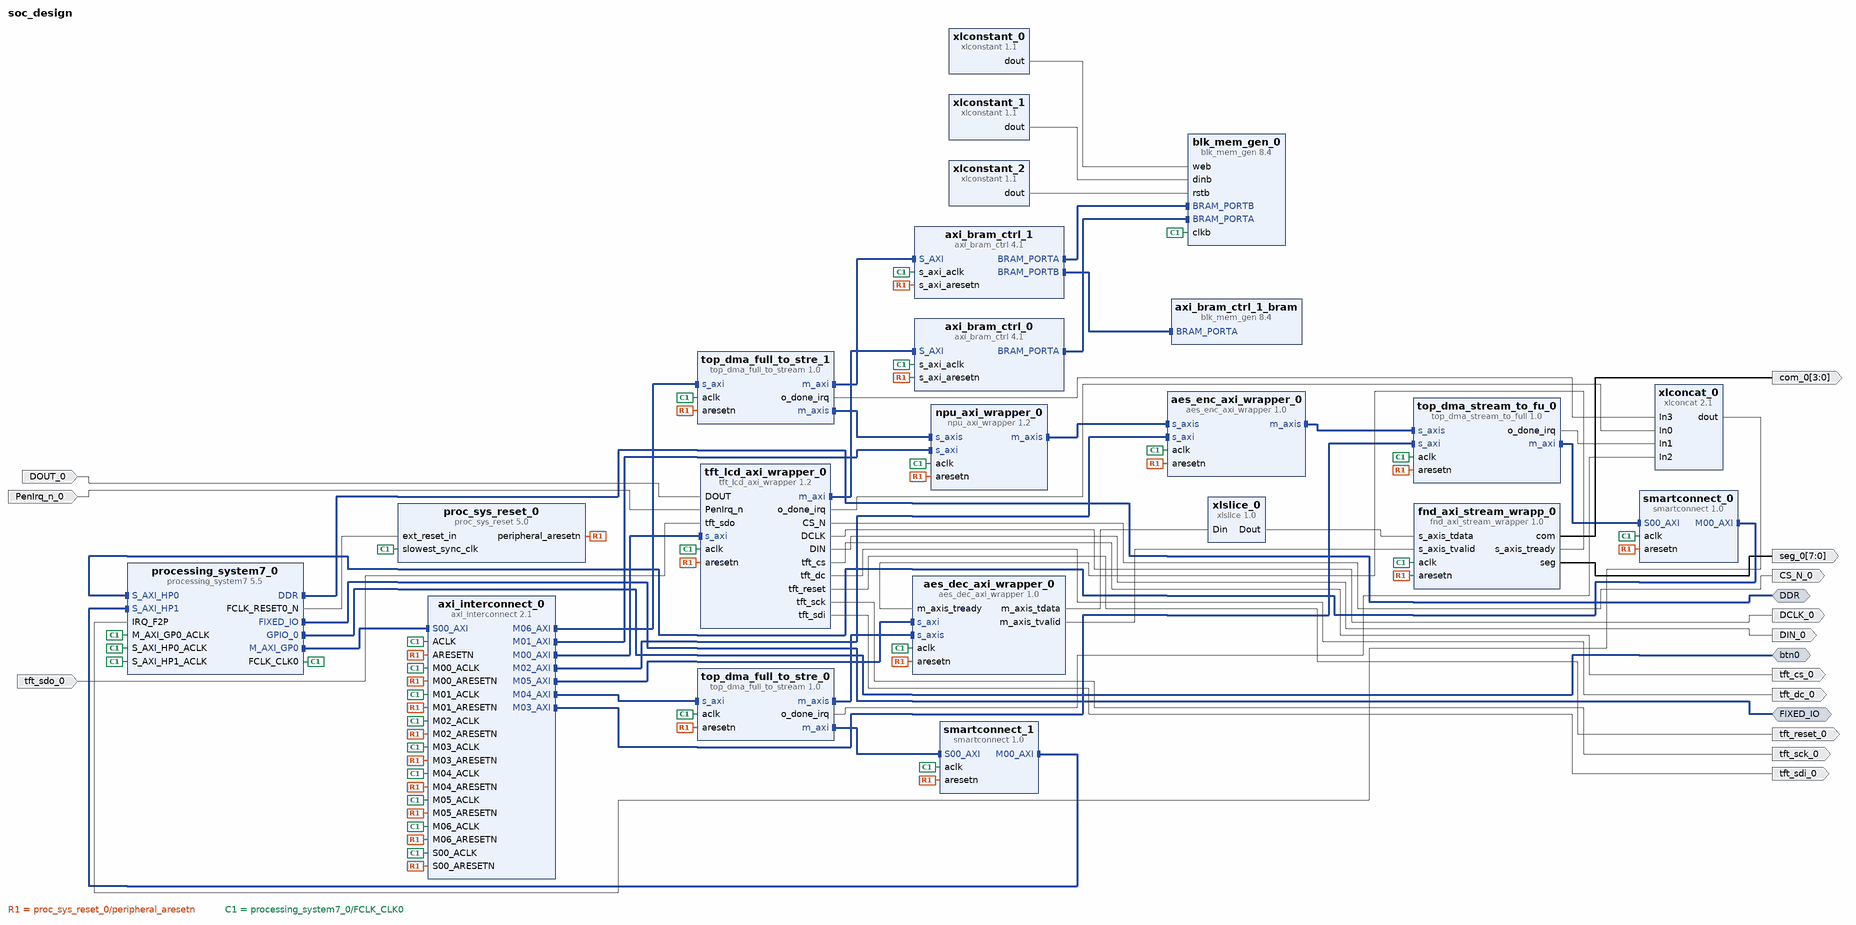
[diagram p0: block diagram of the top level]
# Vivado block design soc_design, xc7z020clg400-1, Vivado 2024.2
create_bd_design soc_design

create_bd_intf_port -mode Master -vlnv xilinx.com:interface:ddrx_rtl:1.0 DDR
create_bd_intf_port -mode Master -vlnv xilinx.com:display_processing_system7:fixedio_rtl:1.0 FIXED_IO
create_bd_intf_port -mode Master -vlnv xilinx.com:interface:gpio_rtl:1.0 btn0
create_bd_port -dir O -from 7 -to 0 seg_0
create_bd_port -dir O -from 3 -to 0 com_0
create_bd_port -dir O CS_N_0
create_bd_port -dir O DCLK_0
create_bd_port -dir O DIN_0
create_bd_port -dir I DOUT_0
create_bd_port -dir I PenIrq_n_0
create_bd_port -dir O tft_cs_0
create_bd_port -dir O tft_dc_0
create_bd_port -dir O tft_reset_0
create_bd_port -dir O tft_sck_0
create_bd_port -dir O tft_sdi_0
create_bd_port -dir I tft_sdo_0

create_bd_cell -type ip -vlnv xilinx.com:ip:processing_system7:5.5 processing_system7_0
set_property -dict [list \
  CONFIG.PCW_APU_PERIPHERAL_FREQMHZ 667 \
  CONFIG.PCW_ENET0_ENET0_IO {MIO 16 .. 27} \
  CONFIG.PCW_ENET0_GRP_MDIO_ENABLE 1 \
  CONFIG.PCW_ENET0_GRP_MDIO_IO {MIO 52 .. 53} \
  CONFIG.PCW_ENET0_PERIPHERAL_ENABLE 1 \
  CONFIG.PCW_ENET0_RESET_ENABLE 0 \
  CONFIG.PCW_ENET_RESET_ENABLE 1 \
  CONFIG.PCW_ENET_RESET_SELECT {Share reset pin} \
  CONFIG.PCW_FPGA0_PERIPHERAL_FREQMHZ 50 \
  CONFIG.PCW_FPGA1_PERIPHERAL_FREQMHZ 50 \
  CONFIG.PCW_GPIO_EMIO_GPIO_ENABLE 1 \
  CONFIG.PCW_GPIO_EMIO_GPIO_IO 1 \
  CONFIG.PCW_GPIO_EMIO_GPIO_WIDTH 1 \
  CONFIG.PCW_GPIO_MIO_GPIO_ENABLE 1 \
  CONFIG.PCW_GPIO_MIO_GPIO_IO MIO \
  CONFIG.PCW_I2C_RESET_ENABLE 1 \
  CONFIG.PCW_IRQ_F2P_INTR 1 \
  CONFIG.PCW_PERIPHERAL_BOARD_PRESET part0 \
  CONFIG.PCW_PRESET_BANK1_VOLTAGE {LVCMOS 1.8V} \
  CONFIG.PCW_QSPI_GRP_FBCLK_ENABLE 1 \
  CONFIG.PCW_QSPI_GRP_FBCLK_IO {MIO 8} \
  CONFIG.PCW_QSPI_GRP_SINGLE_SS_ENABLE 1 \
  CONFIG.PCW_QSPI_GRP_SINGLE_SS_IO {MIO 1 .. 6} \
  CONFIG.PCW_QSPI_PERIPHERAL_ENABLE 1 \
  CONFIG.PCW_QSPI_QSPI_IO {MIO 1 .. 6} \
  CONFIG.PCW_SD0_GRP_CD_ENABLE 1 \
  CONFIG.PCW_SD0_GRP_CD_IO {MIO 47} \
  CONFIG.PCW_SD0_GRP_WP_ENABLE 0 \
  CONFIG.PCW_SD0_PERIPHERAL_ENABLE 1 \
  CONFIG.PCW_SD0_SD0_IO {MIO 40 .. 45} \
  CONFIG.PCW_SDIO_PERIPHERAL_FREQMHZ 50 \
  CONFIG.PCW_SINGLE_QSPI_DATA_MODE x4 \
  CONFIG.PCW_UART1_PERIPHERAL_ENABLE 1 \
  CONFIG.PCW_UART1_UART1_IO {MIO 48 .. 49} \
  CONFIG.PCW_UART_PERIPHERAL_FREQMHZ 100 \
  CONFIG.PCW_UIPARAM_DDR_FREQ_MHZ 533.333333 \
  CONFIG.PCW_UIPARAM_DDR_MEMORY_TYPE {DDR 3 (Low Voltage)} \
  CONFIG.PCW_UIPARAM_DDR_PARTNO {MT41K256M16 RE-125} \
  CONFIG.PCW_USB0_PERIPHERAL_ENABLE 1 \
  CONFIG.PCW_USB0_RESET_ENABLE 1 \
  CONFIG.PCW_USB0_RESET_IO {MIO 46} \
  CONFIG.PCW_USB0_USB0_IO {MIO 28 .. 39} \
  CONFIG.PCW_USB_RESET_ENABLE 1 \
  CONFIG.PCW_USB_RESET_SELECT {Share reset pin} \
  CONFIG.PCW_USE_FABRIC_INTERRUPT 1 \
  CONFIG.PCW_USE_S_AXI_HP0 1 \
  CONFIG.PCW_USE_S_AXI_HP1 1 \
  CONFIG.preset None \
] [get_bd_cells processing_system7_0]
# 509 more settings of processing_system7_0 are not shown: defaults, MIO pin electricals, DDR timing, and values the tool derives
create_bd_cell -type ip -vlnv xilinx.com:ip:proc_sys_reset:5.0 proc_sys_reset_0
create_bd_cell -type ip -vlnv xilinx.com:user:top_dma_stream_to_full:1.0 top_dma_stream_to_fu_0
create_bd_cell -type ip -vlnv xilinx.com:user:aes_dec_axi_wrapper:1.0 aes_dec_axi_wrapper_0
create_bd_cell -type ip -vlnv xilinx.com:user:aes_enc_axi_wrapper:1.0 aes_enc_axi_wrapper_0
create_bd_cell -type ip -vlnv xilinx.com:ip:axi_interconnect:2.1 axi_interconnect_0
set_property -dict {CONFIG.NUM_MI 7} [get_bd_cells axi_interconnect_0]
create_bd_cell -type ip -vlnv xilinx.com:ip:smartconnect:1.0 smartconnect_0
set_property -dict {CONFIG.NUM_SI 1} [get_bd_cells smartconnect_0]
create_bd_cell -type ip -vlnv xilinx.com:ip:smartconnect:1.0 smartconnect_1
set_property -dict {CONFIG.NUM_SI 1} [get_bd_cells smartconnect_1]
create_bd_cell -type ip -vlnv xilinx.com:ip:xlconcat:2.1 xlconcat_0
set_property -dict {CONFIG.NUM_PORTS 4} [get_bd_cells xlconcat_0]
create_bd_cell -type ip -vlnv xilinx.com:user:fnd_axi_stream_wrapper:1.0 fnd_axi_stream_wrapp_0
create_bd_cell -type ip -vlnv xilinx.com:ip:xlslice:1.0 xlslice_0
set_property -dict {CONFIG.DIN_FROM 3 CONFIG.DIN_TO 0 CONFIG.DIN_WIDTH 128 CONFIG.DOUT_WIDTH 4} [get_bd_cells xlslice_0]
create_bd_cell -type ip -vlnv xilinx.com:user:tft_lcd_axi_wrapper:1.2 tft_lcd_axi_wrapper_0
create_bd_cell -type ip -vlnv xilinx.com:ip:blk_mem_gen:8.4 blk_mem_gen_0
set_property -dict {CONFIG.Memory_Type True_Dual_Port_RAM} [get_bd_cells blk_mem_gen_0]
create_bd_cell -type ip -vlnv xilinx.com:ip:xlconstant:1.1 xlconstant_0
set_property -dict {CONFIG.CONST_VAL 0 CONFIG.CONST_WIDTH 4} [get_bd_cells xlconstant_0]
create_bd_cell -type ip -vlnv xilinx.com:ip:xlconstant:1.1 xlconstant_1
set_property -dict {CONFIG.CONST_VAL 0 CONFIG.CONST_WIDTH 32} [get_bd_cells xlconstant_1]
create_bd_cell -type ip -vlnv xilinx.com:ip:xlconstant:1.1 xlconstant_2
set_property -dict {CONFIG.CONST_VAL 0} [get_bd_cells xlconstant_2]
create_bd_cell -type ip -vlnv xilinx.com:ip:axi_bram_ctrl:4.1 axi_bram_ctrl_0
set_property -dict {CONFIG.SINGLE_PORT_BRAM 1} [get_bd_cells axi_bram_ctrl_0]
create_bd_cell -type ip -vlnv xilinx.com:user:top_dma_full_to_stream:1.0 top_dma_full_to_stre_0
create_bd_cell -type ip -vlnv xilinx.com:user:npu_axi_wrapper:1.2 npu_axi_wrapper_0
create_bd_cell -type ip -vlnv xilinx.com:user:top_dma_full_to_stream:1.0 top_dma_full_to_stre_1
set_property -dict {CONFIG.C_M_AXIS_DATA_WIDTH 32} [get_bd_cells top_dma_full_to_stre_1]
create_bd_cell -type ip -vlnv xilinx.com:ip:axi_bram_ctrl:4.1 axi_bram_ctrl_1
create_bd_cell -type ip -vlnv xilinx.com:ip:blk_mem_gen:8.4 axi_bram_ctrl_1_bram

# ---- connections ----

connect_bd_intf_net [get_bd_intf_pins aes_enc_axi_wrapper_0/m_axis] [get_bd_intf_pins top_dma_stream_to_fu_0/s_axis]
connect_bd_intf_net [get_bd_intf_pins axi_bram_ctrl_0/BRAM_PORTA] [get_bd_intf_pins blk_mem_gen_0/BRAM_PORTA]
connect_bd_intf_net [get_bd_intf_pins axi_bram_ctrl_1/BRAM_PORTA] [get_bd_intf_pins blk_mem_gen_0/BRAM_PORTB]
connect_bd_intf_net [get_bd_intf_pins axi_bram_ctrl_1_bram/BRAM_PORTA] [get_bd_intf_pins axi_bram_ctrl_1/BRAM_PORTB]
connect_bd_intf_net [get_bd_intf_pins axi_interconnect_0/M00_AXI] [get_bd_intf_pins tft_lcd_axi_wrapper_0/s_axi]
connect_bd_intf_net [get_bd_intf_pins axi_interconnect_0/M01_AXI] [get_bd_intf_pins npu_axi_wrapper_0/s_axi]
connect_bd_intf_net [get_bd_intf_pins aes_enc_axi_wrapper_0/s_axi] [get_bd_intf_pins axi_interconnect_0/M02_AXI]
connect_bd_intf_net [get_bd_intf_pins top_dma_stream_to_fu_0/s_axi] [get_bd_intf_pins axi_interconnect_0/M03_AXI]
connect_bd_intf_net [get_bd_intf_pins axi_interconnect_0/M04_AXI] [get_bd_intf_pins top_dma_full_to_stre_0/s_axi]
connect_bd_intf_net [get_bd_intf_pins axi_interconnect_0/M05_AXI] [get_bd_intf_pins aes_dec_axi_wrapper_0/s_axi]
connect_bd_intf_net [get_bd_intf_pins axi_interconnect_0/M06_AXI] [get_bd_intf_pins top_dma_full_to_stre_1/s_axi]
connect_bd_intf_net [get_bd_intf_pins npu_axi_wrapper_0/m_axis] [get_bd_intf_pins aes_enc_axi_wrapper_0/s_axis]
connect_bd_intf_net [get_bd_intf_ports DDR] [get_bd_intf_pins processing_system7_0/DDR]
connect_bd_intf_net [get_bd_intf_ports FIXED_IO] [get_bd_intf_pins processing_system7_0/FIXED_IO]
connect_bd_intf_net [get_bd_intf_ports btn0] [get_bd_intf_pins processing_system7_0/GPIO_0]
connect_bd_intf_net [get_bd_intf_pins processing_system7_0/M_AXI_GP0] [get_bd_intf_pins axi_interconnect_0/S00_AXI]
connect_bd_intf_net [get_bd_intf_pins smartconnect_0/M00_AXI] [get_bd_intf_pins processing_system7_0/S_AXI_HP0]
connect_bd_intf_net [get_bd_intf_pins smartconnect_1/M00_AXI] [get_bd_intf_pins processing_system7_0/S_AXI_HP1]
connect_bd_intf_net [get_bd_intf_pins tft_lcd_axi_wrapper_0/m_axi] [get_bd_intf_pins axi_bram_ctrl_0/S_AXI]
connect_bd_intf_net [get_bd_intf_pins smartconnect_1/S00_AXI] [get_bd_intf_pins top_dma_full_to_stre_0/m_axi]
connect_bd_intf_net [get_bd_intf_pins top_dma_full_to_stre_0/m_axis] [get_bd_intf_pins aes_dec_axi_wrapper_0/s_axis]
connect_bd_intf_net [get_bd_intf_pins top_dma_full_to_stre_1/m_axi] [get_bd_intf_pins axi_bram_ctrl_1/S_AXI]
connect_bd_intf_net [get_bd_intf_pins top_dma_full_to_stre_1/m_axis] [get_bd_intf_pins npu_axi_wrapper_0/s_axis]
connect_bd_intf_net [get_bd_intf_pins smartconnect_0/S00_AXI] [get_bd_intf_pins top_dma_stream_to_fu_0/m_axi]
connect_bd_net -net DOUT_0_1 [get_bd_ports DOUT_0] [get_bd_pins tft_lcd_axi_wrapper_0/DOUT]
connect_bd_net -net PenIrq_n_0_1 [get_bd_ports PenIrq_n_0] [get_bd_pins tft_lcd_axi_wrapper_0/PenIrq_n]
connect_bd_net [get_bd_pins aes_dec_axi_wrapper_0/m_axis_tdata] [get_bd_pins xlslice_0/Din]
connect_bd_net [get_bd_pins aes_dec_axi_wrapper_0/m_axis_tvalid] [get_bd_pins fnd_axi_stream_wrapp_0/s_axis_tvalid]
connect_bd_net [get_bd_pins fnd_axi_stream_wrapp_0/com] [get_bd_ports com_0]
connect_bd_net [get_bd_pins fnd_axi_stream_wrapp_0/s_axis_tready] [get_bd_pins aes_dec_axi_wrapper_0/m_axis_tready]
connect_bd_net [get_bd_pins fnd_axi_stream_wrapp_0/seg] [get_bd_ports seg_0]
connect_bd_net [get_bd_pins proc_sys_reset_0/peripheral_aresetn] \
  [get_bd_pins axi_interconnect_0/M05_ARESETN] [get_bd_pins axi_interconnect_0/M04_ARESETN] \
  [get_bd_pins axi_interconnect_0/M03_ARESETN] [get_bd_pins axi_interconnect_0/M02_ARESETN] \
  [get_bd_pins axi_interconnect_0/M01_ARESETN] [get_bd_pins axi_interconnect_0/M00_ARESETN] \
  [get_bd_pins axi_interconnect_0/S00_ARESETN] [get_bd_pins axi_interconnect_0/ARESETN] [get_bd_pins smartconnect_0/aresetn] \
  [get_bd_pins smartconnect_1/aresetn] [get_bd_pins top_dma_stream_to_fu_0/aresetn] \
  [get_bd_pins aes_dec_axi_wrapper_0/aresetn] [get_bd_pins fnd_axi_stream_wrapp_0/aresetn] \
  [get_bd_pins axi_bram_ctrl_0/s_axi_aresetn] [get_bd_pins top_dma_full_to_stre_0/aresetn] \
  [get_bd_pins aes_enc_axi_wrapper_0/aresetn] [get_bd_pins axi_interconnect_0/M06_ARESETN] \
  [get_bd_pins npu_axi_wrapper_0/aresetn] [get_bd_pins top_dma_full_to_stre_1/aresetn] \
  [get_bd_pins axi_bram_ctrl_1/s_axi_aresetn] [get_bd_pins tft_lcd_axi_wrapper_0/aresetn]
connect_bd_net [get_bd_pins processing_system7_0/FCLK_CLK0] \
  [get_bd_pins proc_sys_reset_0/slowest_sync_clk] [get_bd_pins axi_interconnect_0/ACLK] \
  [get_bd_pins axi_interconnect_0/S00_ACLK] [get_bd_pins axi_interconnect_0/M00_ACLK] \
  [get_bd_pins axi_interconnect_0/M01_ACLK] [get_bd_pins axi_interconnect_0/M02_ACLK] \
  [get_bd_pins axi_interconnect_0/M03_ACLK] [get_bd_pins axi_interconnect_0/M04_ACLK] \
  [get_bd_pins axi_interconnect_0/M05_ACLK] [get_bd_pins smartconnect_1/aclk] [get_bd_pins smartconnect_0/aclk] \
  [get_bd_pins top_dma_stream_to_fu_0/aclk] [get_bd_pins processing_system7_0/S_AXI_HP0_ACLK] \
  [get_bd_pins processing_system7_0/S_AXI_HP1_ACLK] [get_bd_pins processing_system7_0/M_AXI_GP0_ACLK] \
  [get_bd_pins aes_dec_axi_wrapper_0/aclk] [get_bd_pins fnd_axi_stream_wrapp_0/aclk] [get_bd_pins blk_mem_gen_0/clkb] \
  [get_bd_pins axi_bram_ctrl_0/s_axi_aclk] [get_bd_pins top_dma_full_to_stre_0/aclk] [get_bd_pins aes_enc_axi_wrapper_0/aclk] \
  [get_bd_pins axi_interconnect_0/M06_ACLK] [get_bd_pins npu_axi_wrapper_0/aclk] [get_bd_pins top_dma_full_to_stre_1/aclk] \
  [get_bd_pins axi_bram_ctrl_1/s_axi_aclk] [get_bd_pins tft_lcd_axi_wrapper_0/aclk]
connect_bd_net [get_bd_pins processing_system7_0/FCLK_RESET0_N] [get_bd_pins proc_sys_reset_0/ext_reset_in]
connect_bd_net [get_bd_pins tft_lcd_axi_wrapper_0/CS_N] [get_bd_ports CS_N_0]
connect_bd_net [get_bd_pins tft_lcd_axi_wrapper_0/DCLK] [get_bd_ports DCLK_0]
connect_bd_net [get_bd_pins tft_lcd_axi_wrapper_0/DIN] [get_bd_ports DIN_0]
connect_bd_net [get_bd_pins tft_lcd_axi_wrapper_0/o_done_irq] [get_bd_pins xlconcat_0/In0]
connect_bd_net [get_bd_pins tft_lcd_axi_wrapper_0/tft_cs] [get_bd_ports tft_cs_0]
connect_bd_net [get_bd_pins tft_lcd_axi_wrapper_0/tft_dc] [get_bd_ports tft_dc_0]
connect_bd_net [get_bd_pins tft_lcd_axi_wrapper_0/tft_reset] [get_bd_ports tft_reset_0]
connect_bd_net [get_bd_pins tft_lcd_axi_wrapper_0/tft_sck] [get_bd_ports tft_sck_0]
connect_bd_net [get_bd_pins tft_lcd_axi_wrapper_0/tft_sdi] [get_bd_ports tft_sdi_0]
connect_bd_net -net tft_sdo_0_1 [get_bd_ports tft_sdo_0] [get_bd_pins tft_lcd_axi_wrapper_0/tft_sdo]
connect_bd_net [get_bd_pins top_dma_full_to_stre_0/o_done_irq] [get_bd_pins xlconcat_0/In2]
connect_bd_net [get_bd_pins top_dma_full_to_stre_1/o_done_irq] [get_bd_pins xlconcat_0/In3]
connect_bd_net [get_bd_pins top_dma_stream_to_fu_0/o_done_irq] [get_bd_pins xlconcat_0/In1]
connect_bd_net [get_bd_pins xlconcat_0/dout] [get_bd_pins processing_system7_0/IRQ_F2P]
connect_bd_net [get_bd_pins xlconstant_0/dout] [get_bd_pins blk_mem_gen_0/web]
connect_bd_net [get_bd_pins xlconstant_1/dout] [get_bd_pins blk_mem_gen_0/dinb]
connect_bd_net [get_bd_pins xlconstant_2/dout] [get_bd_pins blk_mem_gen_0/rstb]
connect_bd_net [get_bd_pins xlslice_0/Dout] [get_bd_pins fnd_axi_stream_wrapp_0/s_axis_tdata]

# ---- address map ----
assign_bd_address -offset 0x40000000 -range 4K -target_address_space [get_bd_addr_spaces processing_system7_0/Data] [get_bd_addr_segs aes_dec_axi_wrapper_0/s_axi/reg0]
assign_bd_address -offset 0x40001000 -range 4K -target_address_space [get_bd_addr_spaces processing_system7_0/Data] [get_bd_addr_segs aes_enc_axi_wrapper_0/s_axi/reg0]
assign_bd_address -offset 0x40002000 -range 4K -target_address_space [get_bd_addr_spaces processing_system7_0/Data] [get_bd_addr_segs npu_axi_wrapper_0/s_axi/reg0]
assign_bd_address -offset 0x40003000 -range 4K -target_address_space [get_bd_addr_spaces processing_system7_0/Data] [get_bd_addr_segs tft_lcd_axi_wrapper_0/s_axi/reg0]
assign_bd_address -offset 0x40004000 -range 4K -target_address_space [get_bd_addr_spaces processing_system7_0/Data] [get_bd_addr_segs top_dma_full_to_stre_0/s_axi/reg0]
assign_bd_address -offset 0x40005000 -range 4K -target_address_space [get_bd_addr_spaces processing_system7_0/Data] [get_bd_addr_segs top_dma_stream_to_fu_0/s_axi/reg0]
assign_bd_address -offset 0x40006000 -range 4K -target_address_space [get_bd_addr_spaces processing_system7_0/Data] [get_bd_addr_segs top_dma_full_to_stre_1/s_axi/reg0]
assign_bd_address -offset 0xC0000000 -range 8K -target_address_space [get_bd_addr_spaces tft_lcd_axi_wrapper_0/m_axi] [get_bd_addr_segs axi_bram_ctrl_0/S_AXI/Mem0]
assign_bd_address -offset 0x00000000 -range 1G -target_address_space [get_bd_addr_spaces top_dma_full_to_stre_0/m_axi] [get_bd_addr_segs processing_system7_0/S_AXI_HP1/HP1_DDR_LOWOCM]
assign_bd_address -offset 0xC0000000 -range 8K -target_address_space [get_bd_addr_spaces top_dma_full_to_stre_1/m_axi] [get_bd_addr_segs axi_bram_ctrl_1/S_AXI/Mem0]
assign_bd_address -offset 0x00000000 -range 1G -target_address_space [get_bd_addr_spaces top_dma_stream_to_fu_0/m_axi] [get_bd_addr_segs processing_system7_0/S_AXI_HP0/HP0_DDR_LOWOCM]

validate_bd_design
save_bd_design
